# EAGLE schematic 01_main (EAGLE 6.2)
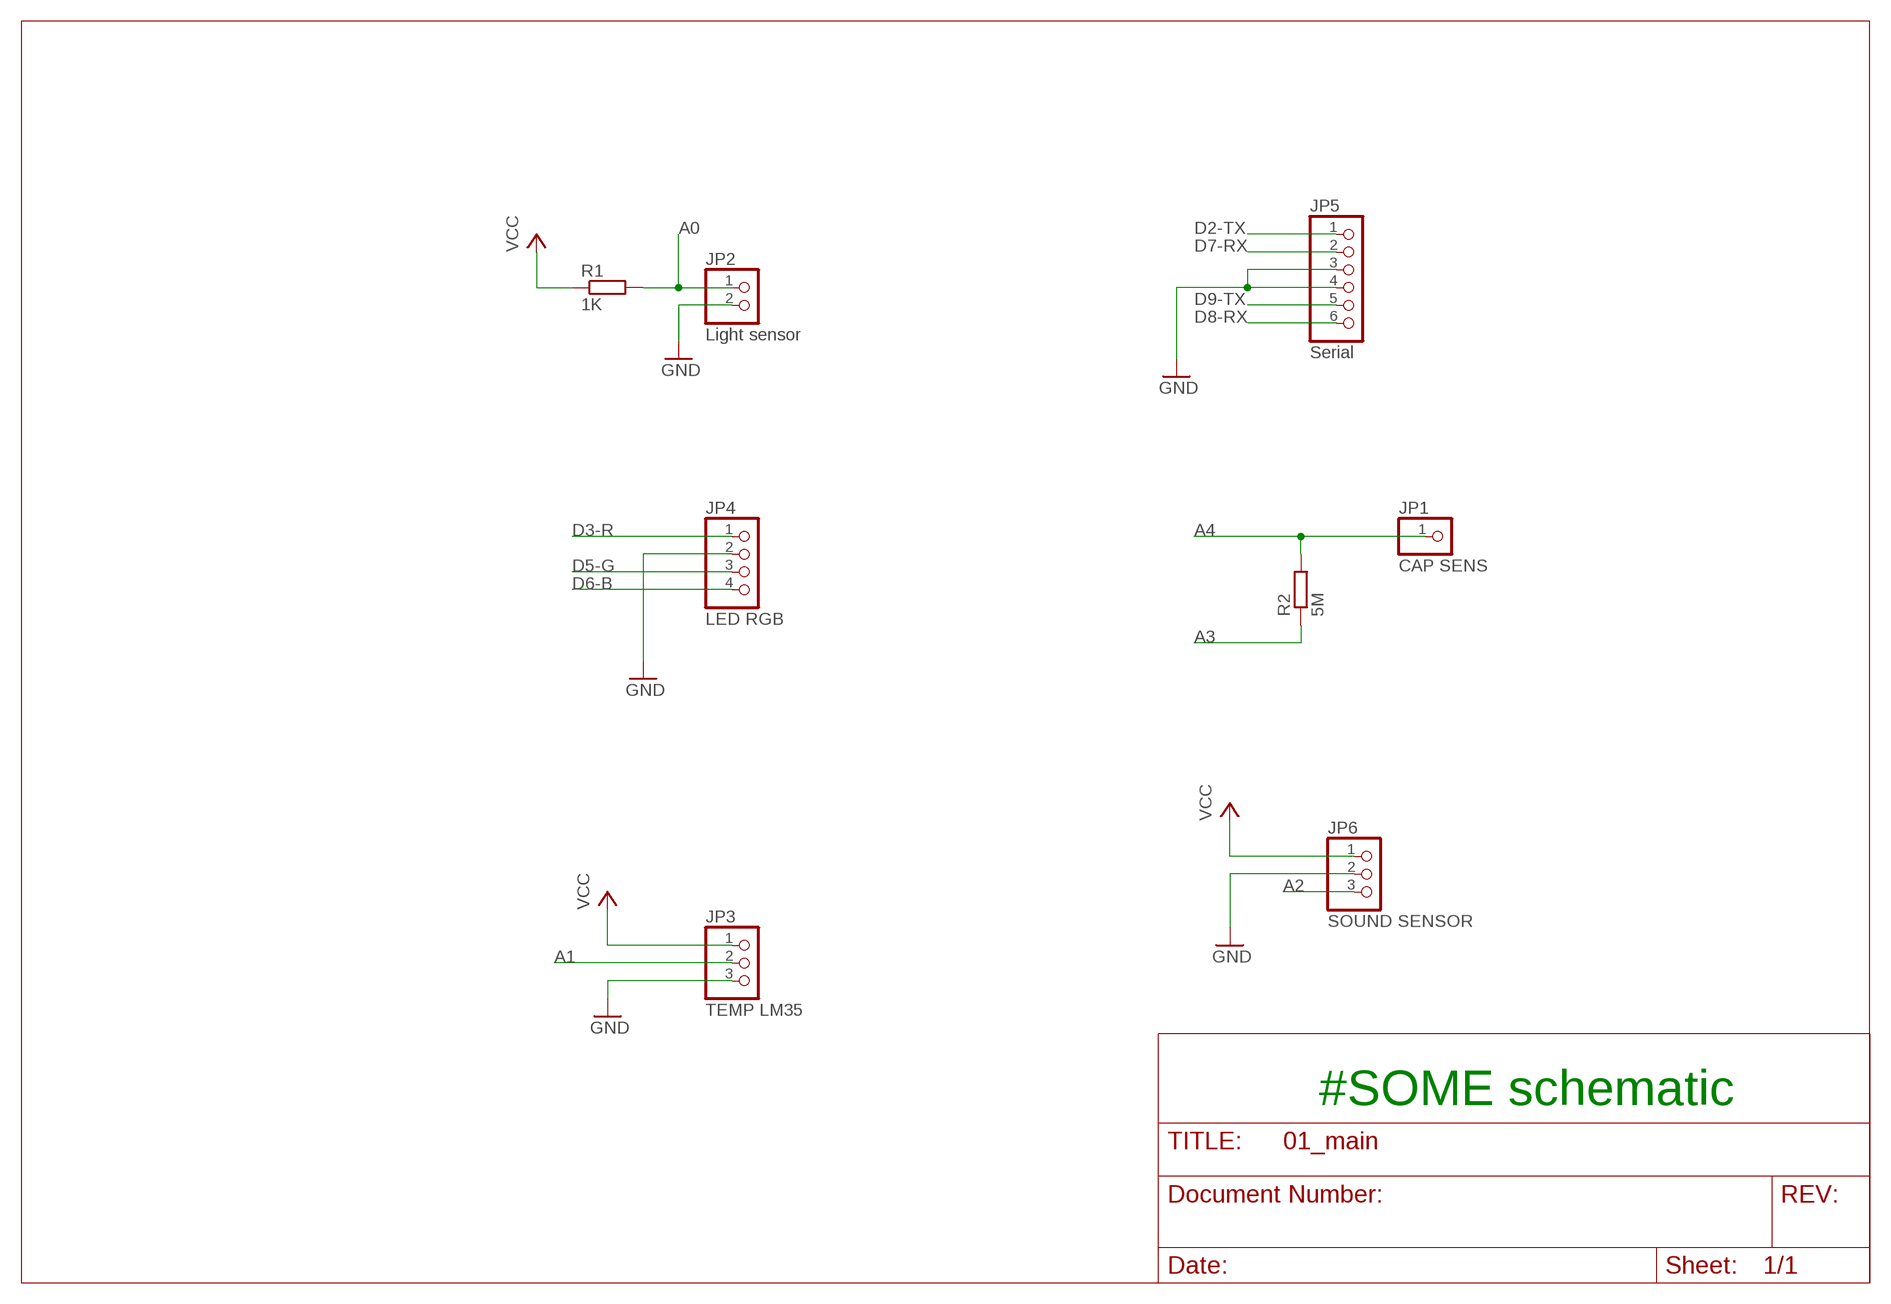
[diagram p0: schematic, sheet 1]

## Parts
JP1  CAP SENS  PINHD-1X1  [1X01]
JP2  Light sensor  PINHD-1X2  [1X02]
JP3  TEMP LM35  PINHD-1X3  [1X03]
JP4  LED RGB  PINHD-1X4  [1X04]
JP5  Serial  PINHD-1X6  [1X06]
JP6  SOUND SENSOR  PINHD-1X3  [1X03]
R1  1K  R-EU_0204/5  [0204/5]
R2  5M  R-EU_0204/5  [0204/5]

## Nets
A0: JP2.1 R1.2
A1: JP3.2
A2: JP6.3
A3: R2.1
A4: JP1.1 R2.2
D2-TX: JP5.1
D3-R: JP4.1
D5-G: JP4.3
D6-B: JP4.4
D7-RX: JP5.2
D8-RX: JP5.6
D9-TX: JP5.5
GND: JP2.2 JP3.3 JP4.2 JP5.3 JP5.4 JP6.2
VCC: JP3.1 JP6.1 R1.1

## Notes on the sheet
- #SOME schematic

## Library data of the parts
JP1 = pinhead:PINHD-1X1: PIN HEADER
JP2 = pinhead:PINHD-1X2: PIN HEADER
JP3 JP6 = pinhead:PINHD-1X3: PIN HEADER
JP4 = pinhead:PINHD-1X4: PIN HEADER
JP5 = pinhead:PINHD-1X6: PIN HEADER
R1 R2 = resistor:R-EU_: RESISTOR, European symbol